# EAGLE schematic 2_RS485_RS422 (EAGLE 7.6.0)
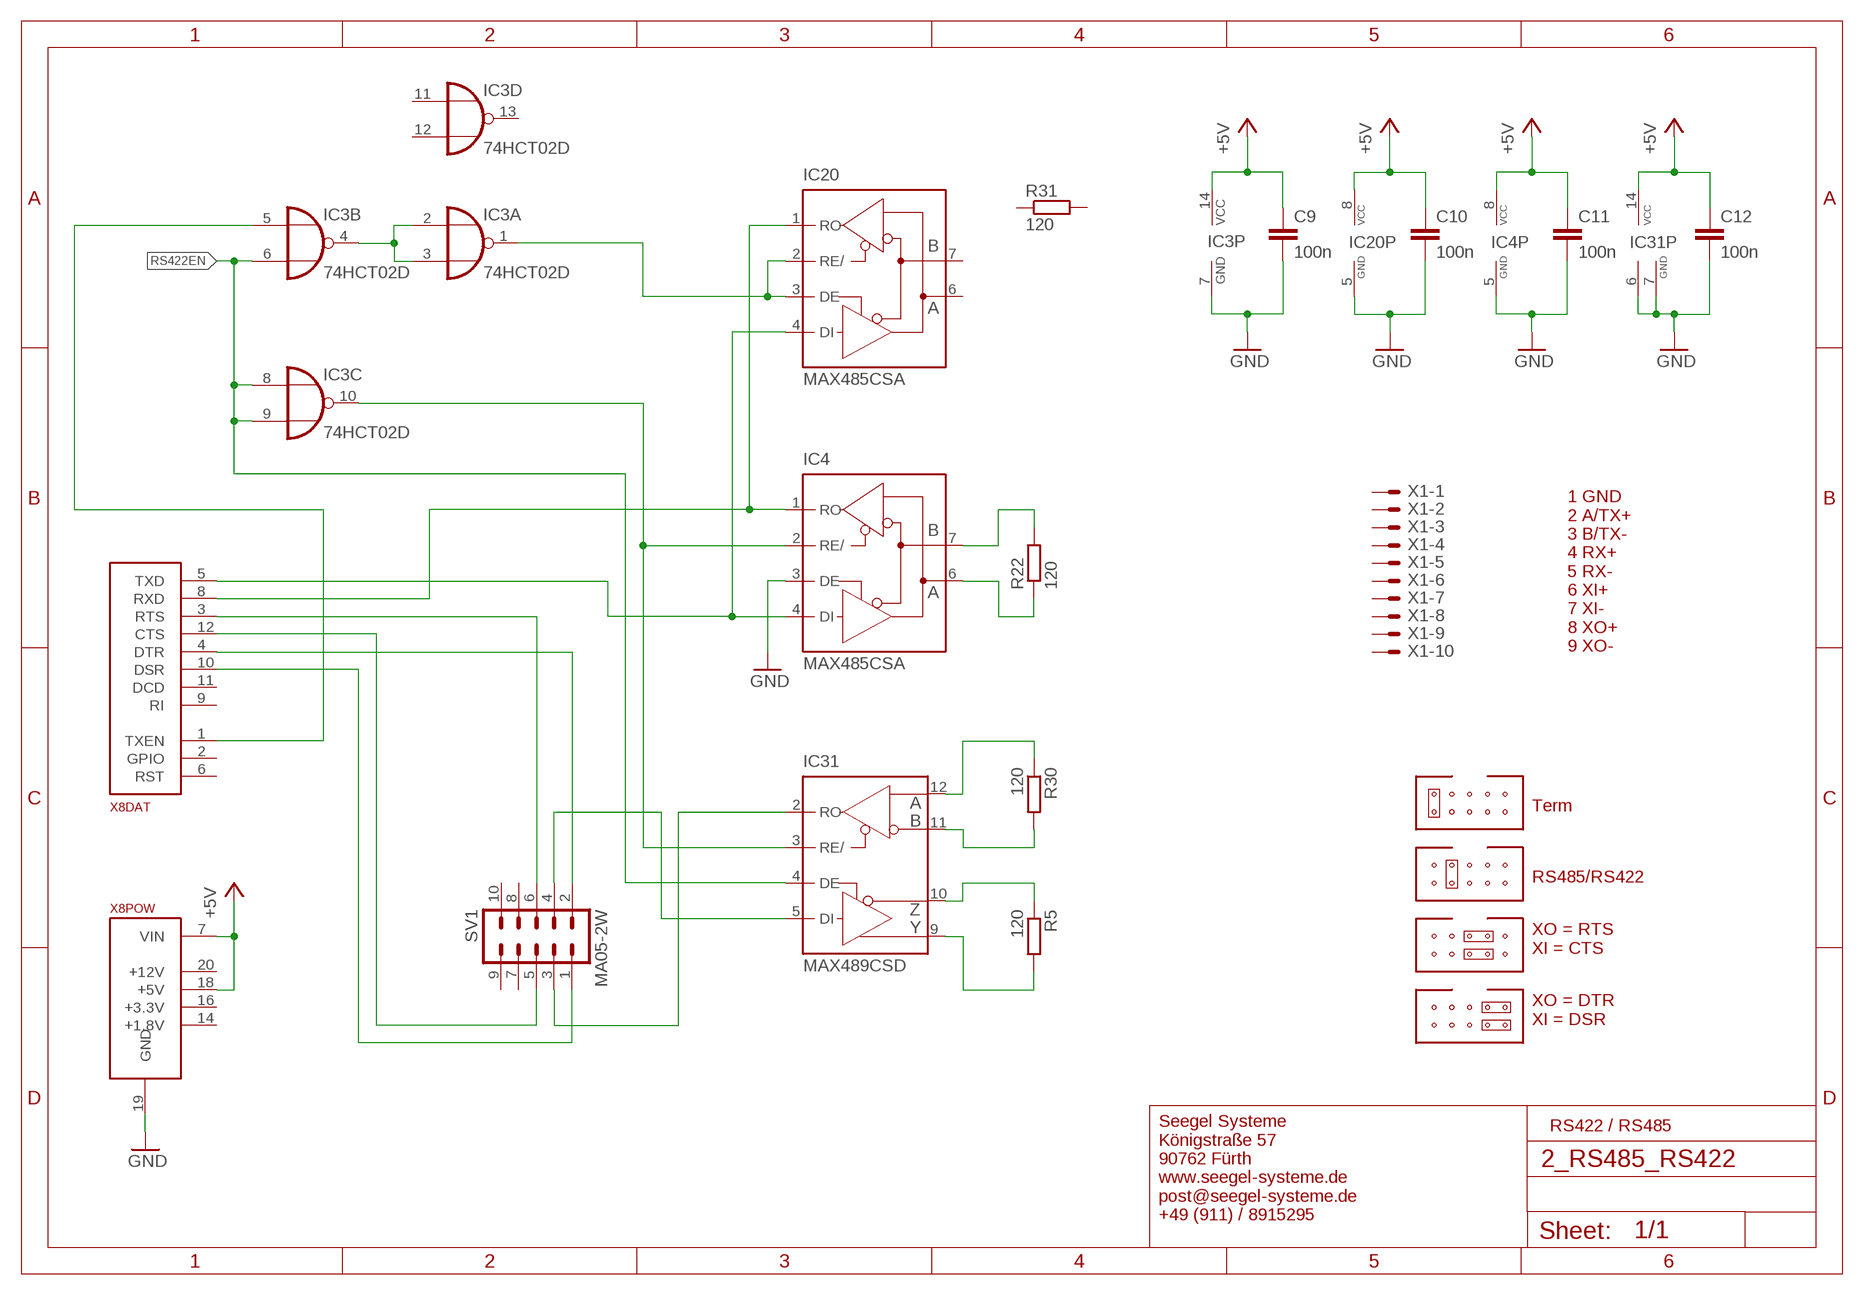
[diagram p0: schematic, sheet 1]

## Parts
C9  100n  C-EUC0805  [C0805]
C10  100n  C-EUC0805  [C0805]
C11  100n  C-EUC0805  [C0805]
C12  100n  C-EUC0805  [C0805]
IC3  74HCT02D  [SO14]
IC4  MAX485CSA  MAX481CSA  [SO08]
IC20  MAX485CSA  MAX481CSA  [SO08]
IC31  MAX489CSD  [SO14]
R5  120  R-EU_R0805  [R0805]
R22  120  R-EU_R0805  [R0805]
R30  120  R-EU_R0805  [R0805]
R31  120  R-EU_R0805  [R0805]
SV1  MA05-2W  [MA05-2W]
X1  AKL18X-10W  [AKL182-10]
X8  ALLSERIALD  [DAUGHTER-THT]

## Nets
+5V: C9.1 C10.1 C11.1 C12.1 IC3.14(P:VCC) IC4.8(VCC) IC20.8(VCC) IC31.14(VCC) X8.7(POW:VIN) X8.18(POW:+5V)
GND: C9.2 C10.2 C11.2 C12.2 IC3.7(P:GND) IC4.3(DE) IC4.5(GND) IC20.5(GND) IC31.6(GND) IC31.7(GND) X8.19(POW:GND)
N$1: IC31.11(B) R30.2
N$2: IC31.10(Z) R5.1
N$10: IC31.9(Y) R5.2
N$37: IC3.5(B:I0) X8.1(DAT:TXEN)
N$39: IC31.12(A) R30.1
N$40: SV1.5 X8.12(DAT:CTS)
N$41: IC4.7(B) R22.2
N$43: IC4.6(A) R22.1
N$48: IC3.2(A:I0) IC3.3(A:I1) IC3.4(B:O)
N$50: IC3.1(A:O) IC20.2(RE/) IC20.3(DE)
N$51: IC3.10(C:O) IC4.2(RE/) IC31.3(RE/)
N$52: IC4.1(RO) IC20.1(RO) X8.8(DAT:RXD)
N$53: IC4.4(DI) IC20.4(DI) X8.5(DAT:TXD)
N$66: SV1.6 X8.3(DAT:RTS)
N$67: SV1.2 X8.4(DAT:DTR)
N$68: IC31.5(DI) SV1.4
N$69: IC31.2(RO) SV1.3
N$70: SV1.1 X8.10(DAT:DSR)
RS422EN: IC3.6(B:I1) IC3.8(C:I0) IC3.9(C:I1) IC31.4(DE)
Unconnected: IC3.11(D:I0) IC3.12(D:I1) IC3.13(D:O) IC20.6(A) IC20.7(B) IC31.1(NC) IC31.8(NC) IC31.13(NC) R31.1 R31.2 SV1.7 SV1.8 SV1.9 SV1.10 X1.P$1 X1.P$2 X1.P$3 X1.P$4 X1.P$5 X1.P$6 X1.P$7 X1.P$8 X1.P$9 X1.P$10 X8.2(DAT:GPIO) X8.6(DAT:RST) X8.9(DAT:RI) X8.11(DAT:DCD) X8.14(POW:+1.8V) X8.16(POW:+3.3V) X8.20(POW:+12V)

## Notes on the sheet
- 1 GND
  2 A/TX+
  3 B/TX-
  4 RX+
  5 RX-
  6 XI+
  7 XI-
  8 XO+
  9 XO-
- Term
- RS485/RS422
- XO = RTS
  XI = CTS
- XO = DTR
  XI = DSR
- RS422 / RS485
- Seegel Systeme
  Königstraße 57
  90762 Fürth
  www.seegel-systeme.de
  post@seegel-systeme.de
  +49 (911) / 8915295

## Library data of the parts
C9-C12 = rcl:C-EU: CAPACITOR, European symbol
IC3 = 74xx-eu:74*02: Quad 2-input NOR gate
IC4 IC20 = maxim:MAX481CSA: RS485 TRANSEIVER; MF: MAXIM; MPN: MAX481CSA; OC_FARNELL: unknown; OC_NEWARK: 90C3817
IC31 = maxim:MAX489CSD: RS485 TRANSEIVER; MF: MAXIM; MPN: MAX489CSD; OC_FARNELL: 9724559; OC_NEWARK: 34C3923
R5 R22 R30 R31 = rcl:R-EU_: RESISTOR, European symbol
SV1 = con-lstb:MA05-2W
X1 = con-riacon_akl:AKL18X-10: Riacon AKL18X Steckverbinder 10-Pol Grid = 3,5mm
X8 = AllSerial:ALLSERIAL